# EAGLE design RoboticArm (EAGLE 9.5.1)
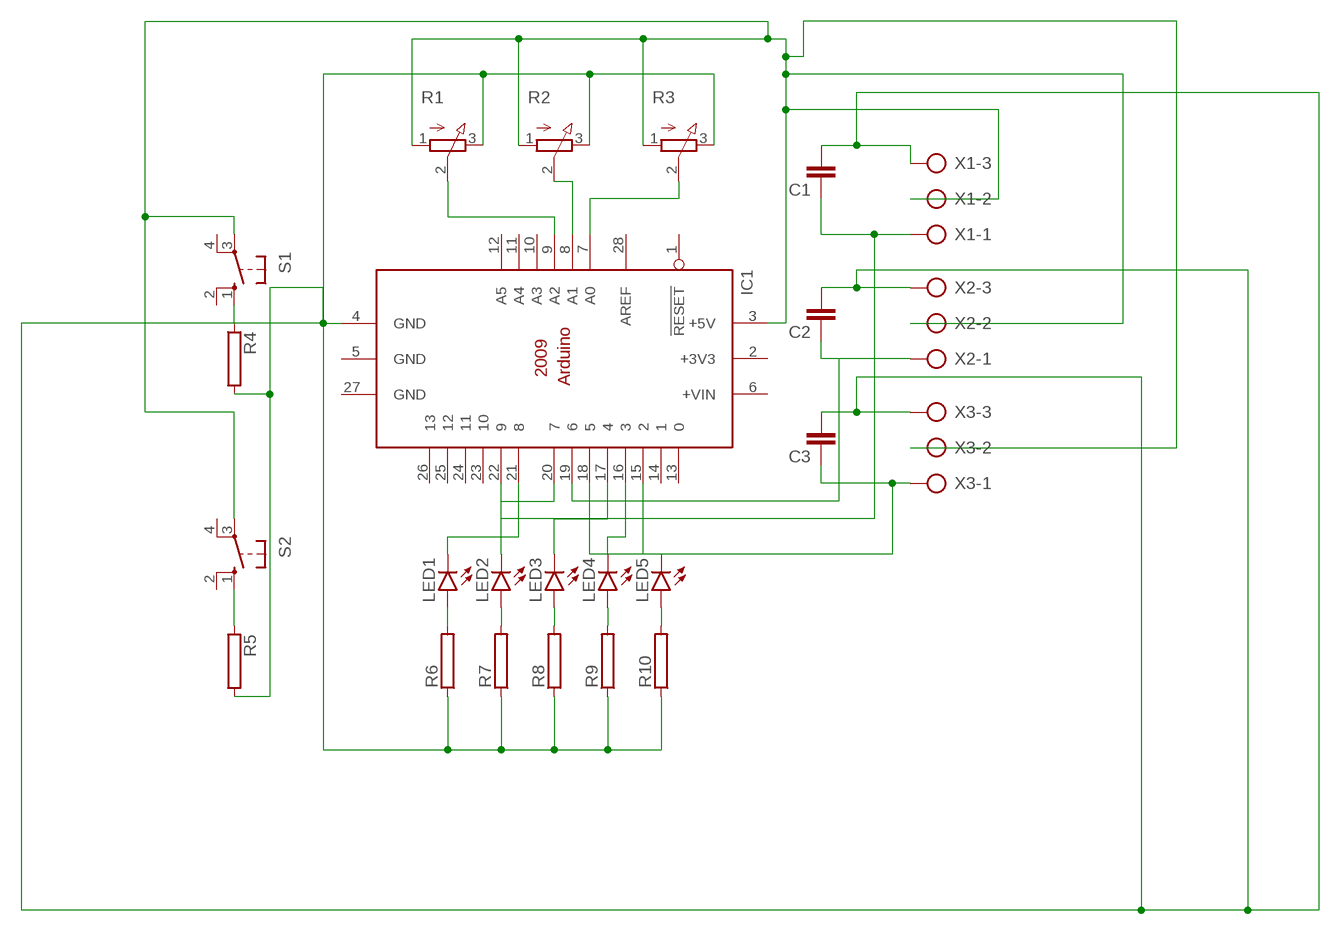
[diagram p0: schematic, sheet 1]

## Parts
C1  C2.5/2  [C2.5-2]
C2  C2.5/2  [C2.5-2]
C3  C2.5/2  [C2.5-2]
IC1  ARDUINO2009_10  [ARDUINO2009]
LED1  LED3MM  [LED3MM]
LED2  LED3MM  [LED3MM]
LED3  LED3MM  [LED3MM]
LED4  LED3MM  [LED3MM]
LED5  LED3MM  [LED3MM]
R1  3RP/1610N  [3RP/1610N]
R2  3RP/1610N  [3RP/1610N]
R3  3RP/1610N  [3RP/1610N]
R4  RAC01  [AC01]
R5  RAC01  [AC01]
R6  RAC01  [AC01]
R7  RAC01  [AC01]
R8  RAC01  [AC01]
R9  RAC01  [AC01]
R10  RAC01  [AC01]
S1  10-XX  [B3F-10XX]
S2  10-XX  [B3F-10XX]
X1  AK300/3  [AK300/3]
X2  AK300/3  [AK300/3]
X3  AK300/3  [AK300/3]

## Nets
N$1: LED1.A R6.2
N$2: IC1.15 LED5.K(C)
N$3: IC1.16 LED4.K(C)
N$4: IC1.17 LED3.K(C)
N$5: IC1.20 LED2.K(C)
N$6: IC1.21 LED1.K(C)
N$7: LED2.A R7.2
N$8: LED3.A R8.2
N$9: LED4.A R9.2
N$10: LED5.A R10.2
N$11: IC1.7(A0) R3.2(S)
N$12: R4.1 S1.1(S)
N$13: R5.1 S2.1(S)
N$14: C1.1 IC1.22 X1.1
N$15: IC1.9(A2) R1.2(S)
N$16: IC1.8(A1) R2.2(S)
N$17: IC1.3(+5V) R1.1(A) R2.1(A) R3.1(A) S1.3(P) S2.3(P) X1.2 X2.2 X3.2
N$18: C2.1 IC1.19 X2.1
N$21: C1.2 C2.2 C3.2 IC1.4(GND) R1.3(E) R2.3(E) R3.3(E) R4.2 R5.2 R6.1 R7.1 R8.1 R9.1 R10.1 X1.3 X2.3 X3.3
N$25: C3.1 IC1.18 X3.1
Unconnected: IC1.1(!RESET) IC1.6(+VIN) IC1.10(A3) IC1.11(A4) IC1.12(A5) IC1.13 IC1.14 IC1.23 IC1.24 IC1.25 IC1.26 IC1.28(AREF) S1.2(S1) S1.4(P1) S2.2(S1) S2.4(P1)

## Power pins joined to a net without a drawn wire
+3V3: IC1.2(+3V3)
GND: IC1.5(GND) IC1.27(GND)

## Library data of the parts
C1-C3 = capacitor-wima:C: CAPACITOR naming: grid - package width
IC1 = arduino:ARDUINO2009_1: The Arduino Duemilanove ("2009") is a microcontroller board based on the ATmega168 or ATmega328. - 14 digital input/output pins (of which 6 can be used as PWM outputs) - 6 analog inputs, a 16 MHz crystal oscillator - USB connection - power jack - ISP header - reset button It contains everything needed to support the microcontroller; simply connect it to a computer with a USB cable or power it with a AC-to-DC adapter or battery to get started http://arduino.cc/en/Main/ArduinoBoardDuemilanove
LED1-LED5 = led:LED: LED OSRAM: - CHIPLED LG R971, LG N971, LY N971, LG Q971, LY Q971, LO R971, LY R971 LH N974, LH R974 LS Q976, LO Q976, LY Q976 LO Q996 - Hyper CHIPLED LW Q18S LB Q993, LB Q99A, LB R99A - SideLED LS A670, LO A670, LY A670, LG A670, LP A670 LB A673, LV A673, LT A673, LW A673 LH A674 LY A675 LS A676, LA A676, LO A676, LY A676, LW A676 LS A679, LY A679, LG A679 - Hyper Micro SIDELED® LS Y876, LA Y876, LO Y876, LY Y876 LT Y87S - SmartLED LW L88C, LW L88S LB L89C, LB L89S, LG L890 LS L89K, LO L89K, LY L89K LS L896, LA L896, LO L896, LY L896 - TOPLED LS T670, LO T670, LY T670, LG T670, LP T670 LSG T670, LSP T670, LSY T670, LOP T670, LYG T670 LG T671, LOG T671, LSG T671 LB T673, LV T673, LT T673, LW T673 LH T674 LS T676, LA T676, LO T676, LY T676, LB T676, LH T676, LSB T676, LW T676 LB T67C, LV T67C, LT T67C, LS T67K, LO T67K, LY T67K, LW E67C LS E67B, LA E67B, LO E67B, LY E67B, LB E67C, LV E67C, LT E67C LW T67C LS T679, LY T679, LG T679 LS T770, LO T770, LY T770, LG T770, LP T770 LB T773, LV T773, LT T773, LW T773 LH T774 LS E675, LA E675, LY E675, LS T675 LS T776, LA T776, LO T776, LY T776, LB T776 LHGB T686 LT T68C, LB T68C - Hyper Mini TOPLED® LB M676 - Mini TOPLED Santana® LG M470 LS M47K, LO M47K, LY M47K Source: http://www.osram.convergy.de LUXEON: - LUMILED® LXK2-PW12-R00, LXK2-PW12-S00, LXK2-PW14-U00, LXK2-PW14-V00 LXK2-PM12-R00, LXK2-PM12-S00, LXK2-PM14-U00 LXK2-PE12-Q00, LXK2-PE12-R00, LXK2-PE12-S00, LXK2-PE14-T00, LXK2-PE14-U00 LXK2-PB12-K00, LXK2-PB12-L00, LXK2-PB12-M00, LXK2-PB14-N00, LXK2-PB14-P00, LXK2-PB14-Q00 LXK2-PR12-L00, LXK2-PR12-M00, LXK2-PR14-Q00, LXK2-PR14-R00 LXK2-PD12-Q00, LXK2-PD12-R00, LXK2-PD12-S00 LXK2-PH12-R00, LXK2-PH12-S00 LXK2-PL12-P00, LXK2-PL12-Q00, LXK2-PL12-R00 Source: www.luxeon.com KINGBRIGHT: KA-3528ASYC Source: www.kingbright.com
R1-R3 = pot:3RP/1610N: 16mm Potentiometer one level Source: http://www.alphapotentiometers.net/html/16mm_pot_2.html
R4-R10 = resistor-power:R: Power Resitor; OC_FARNELL: unknown; OC_NEWARK: unknown
S1 S2 = switch-omron:10-XX: OMRON SWITCH; MPN: B3F-1000; OC_FARNELL: 176432; OC_NEWARK: 36M3542
X1-X3 = con-ptr500:AK300/3: CONNECTOR; OC_FARNELL: unknown; OC_NEWARK: unknown

## Net classes
0 default: width 1.016 mm, clearance 0.254 mm

## Board
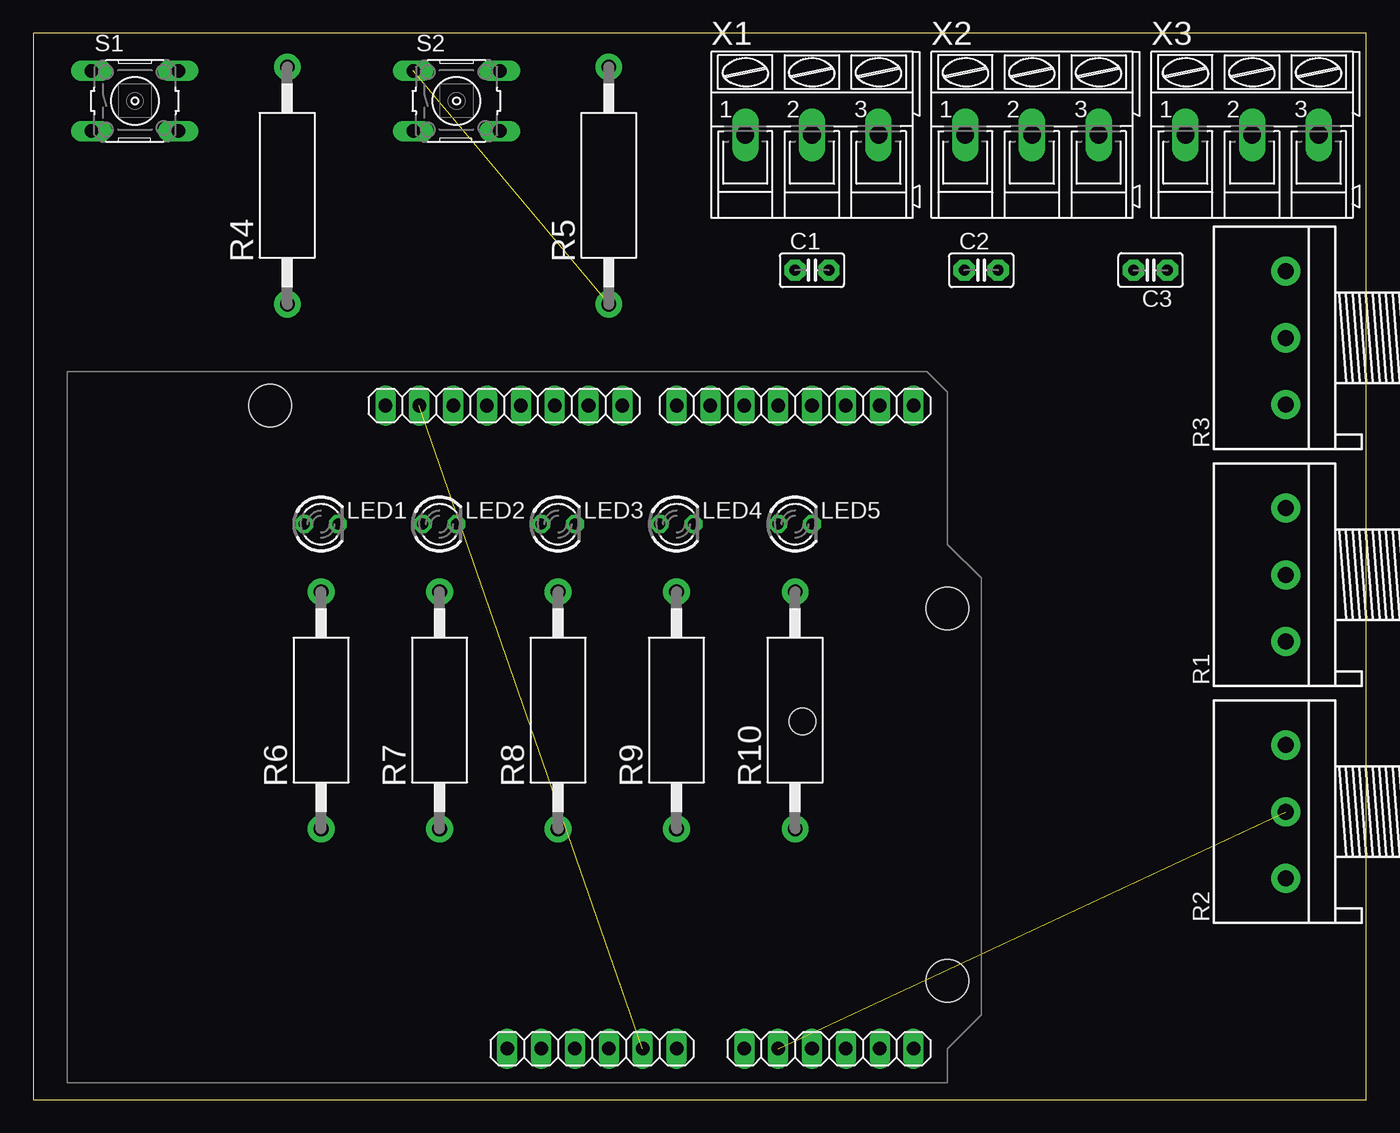
[diagram p1: board, top side]
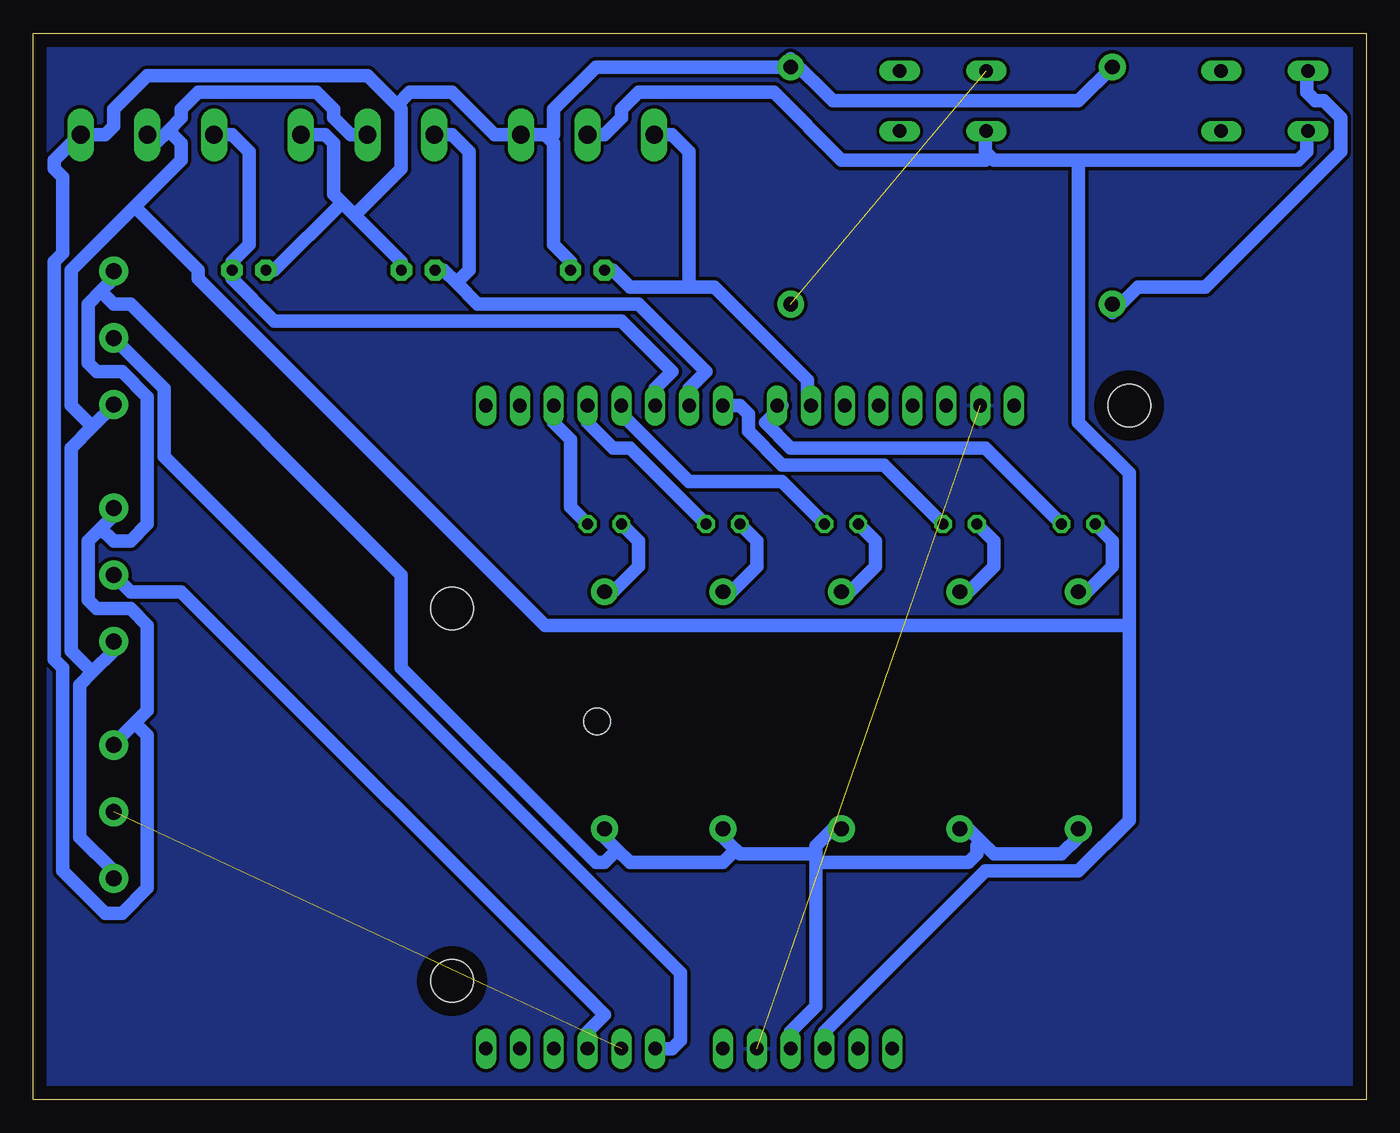
[diagram p2: board, bottom side, seen from below]

Size 100 x 80 mm. Coordinates in mm from the lower left corner, seen from the top.
Outline: 0,0 100,0 100,80 0,80 0,0
Copper layers (1*16): Top 0.035mm / dielectric 1.5mm / Bottom 0.035mm
Design rules "default": minimum track width 6mil, minimum drill 0.35mm, track to track 6mil, track to pad 6mil, pad to pad 6mil, via to via 6mil, smd to smd 6mil, copper to edge 40mil, drill to drill 6mil, minimum pad ring 10mil, minimum via ring 8mil, stop-mask expansion 4mil, vias tented up to drill 0mil, thermal gap 10mil

### Footprints (pad centres in the part's own frame; a part is rotated, then mirrored left to right if it is on the bottom)
C2.5-2 = drill 0.813 pad 1.6 octagon: 1 -1.27,0; 2 1.27,0
ARDUINO2009 = drill 1.016 long: 1 33.02,2.54; 2 35.56,2.54; 3 38.1,2.54; 4 40.64,2.54; 5 43.18,2.54; 6 45.72,2.54; 7 50.8,2.54; 8 53.34,2.54; 9 55.88,2.54; 10 58.42,2.54; 11 60.96,2.54; 12 63.5,2.54; 13 63.5,50.8; 14 60.96,50.8; 15 58.42,50.8; 16 55.88,50.8; 17 53.34,50.8; 18 50.8,50.8; 19 48.26,50.8; 20 45.72,50.8; 21 41.656,50.8; 22 39.116,50.8; 23 36.576,50.8; 24 34.036,50.8; 25 31.496,50.8; 26 28.956,50.8; 27 26.416,50.8; 28 23.876,50.8 | hole 3.2: 15.24,50.8; 66.04,35.56; 66.04,7.62 | hole 2: 55.17,27.114
LED3MM = drill 0.813 octagon: A -1.27,0; K 1.27,0
3RP/1610N = drill 1.2 pad 2.184: 1 -5,0; 2 0,0; 3 5,0
AC01 = drill 1.1 pad 2: 1 -8.9,0; 2 8.9,0
B3F-10XX = drill 1.016 long: 1 -3.251,2.261; 2 3.251,2.261; 3 -3.251,-2.261; 4 3.251,-2.261
AK300/3 = drill 1.321 long: 1 -5.004,0; 2 0,0; 3 5.004,0

### Placement (x,y rotation side)
C1  58.42,62.23 0 top
C2  71.12,62.23 0 top
C3  83.82,62.23 180 top
IC1  2.54,1.27 0 top
LED1  21.59,43.18 0 top
LED2  30.48,43.18 0 top
LED3  39.37,43.18 0 top
LED4  48.26,43.18 0 top
LED5  57.15,43.18 0 top
R1  93.98,39.37 90 top
R2  93.98,21.59 90 top
R3  93.98,57.15 90 top
R4  19.05,68.58 90 top
R5  43.18,68.58 90 top
R6  21.59,29.21 90 top
R7  30.48,29.21 90 top
R8  39.37,29.21 90 top
R9  48.26,29.21 90 top
R10  57.15,29.21 90 top
S1  7.62,74.93 0 top
S2  31.75,74.93 0 top
X1  58.42,72.39 0 top
X2  74.93,72.39 0 top
X3  91.44,72.39 0 top

### Tracks (layer width: path | path; a pad name or v marks a point on that pad's centre or on a via)
GND  (1 unrouted)
  pour Bottom: 0,80.01 0,0 100.33,0 100.33,80.01
N$1
  Bottom 1.016: LED1.A 19.05,41.91 19.05,40.01 20.95,38.1 R6.2
N$2
  Bottom 1.016: LED5.K 59.69,44.45 59.69,49.53 60.96,50.8 IC1.15
N$3
  Bottom 1.016: LED4.K 55.24,48.9 56.52,48.9 58.42,50.8 IC1.16
N$4
  Bottom 1.016: LED3.K 43.81,46.35 50.8,46.35 55.88,51.44 IC1.17
N$5
  Bottom 1.016: LED2.K 36.2,47.62 43.81,47.62 46.35,50.16 46.35,51.44 46.99,52.07 IC1.20
N$6
  Bottom 1.016: LED1.K 28.57,48.9 43.18,48.9 45.09,50.8 43.81,52.07 IC1.21
N$7
  Bottom 1.016: LED2.A 27.94,41.91 27.94,40.01 29.84,38.1 R7.2
N$8
  Bottom 1.016: LED3.A 36.83,41.91 36.83,40.01 38.73,38.1 R8.2
N$9
  Bottom 1.016: LED4.A 45.72,41.91 45.72,40.01 47.62,38.1 R9.2
N$10
  Bottom 1.016: LED5.A 54.61,41.91 54.61,40.01 56.52,38.1 R10.2
N$11
  Bottom 1.016: IC1.7 52.07,3.81 51.44,4.45 51.44,9.53 90.17,48.26 90.17,53.34 R3.2
N$12
  Bottom 1.016: S1.1 4.45,76.83 4.45,75.56 3.81,74.93 3.17,74.93 1.91,73.66 1.91,71.12 12.06,60.96 17.14,60.96 19.05,59.05 R4.1
N$13  (1 unrouted)
N$14
  Bottom 1.016: 50.8,60.96 55.24,60.96 56.52,62.23 C1.1 | 50.8,60.96 48.9,60.96 41.91,53.98 41.91,52.07 IC1.22 | X1.1 52.07,72.39 50.8,71.12 50.8,60.96
N$15
  Bottom 1.016: IC1.9 58.42,5.08 57.15,6.35 88.9,38.1 92.71,38.1 R1.2
N$16  (1 unrouted)
N$17
  Bottom 1.016: X2.2 76.2,72.39 77.47,73.66 77.47,74.3 78.74,75.56 87.63,75.56 88.9,74.3 88.9,73.66 89.85,72.71 | 89.85,72.71 90.81,71.75 91.44,71.75 X3.2 | 95.57,32.07 93.98,33.66 R1.1 | 95.57,32.07 96.52,31.11 96.52,19.68 93.98,17.14 R2.1 | 95.57,50.48 97.16,48.9 97.16,33.66 95.57,32.07 | 95.57,50.48 93.98,52.07 R3.1 | 89.85,72.71 88.9,71.75 88.9,70.48 92.39,66.99 | 92.39,66.99 97.16,62.23 97.16,52.07 95.57,50.48 | 21.59,70.48 27.94,70.48 28.26,70.8 | 21.59,70.48 5.08,70.48 4.45,71.12 4.45,72.39 S1.3 | 28.26,70.8 28.57,71.12 28.57,72.39 S2.3 | IC1.3 40.64,5.08 28.57,17.14 21.59,17.14 17.78,20.95 17.78,35.56 | 17.78,35.56 17.78,46.99 21.59,50.8 21.59,70.48 | X1.2 57.15,72.39 55.88,73.66 55.88,74.3 54.61,75.56 44.45,75.56 39.37,70.48 28.57,70.48 28.26,70.8 | 92.39,66.99 87.63,62.23 87.63,61.59 61.59,35.56 17.78,35.56
N$18
  Bottom 1.016: IC1.19 50.8,53.34 49.53,54.61 54.61,59.69 66.67,59.69 68.26,61.28 | 68.26,61.28 69.22,62.23 C2.1 | X2.1 68.58,72.39 67.31,71.12 67.31,62.23 68.26,61.28
N$21
  Bottom 1.016: R4.2 21.59,74.93 40.01,74.93 43.18,78.11 R5.2 57.78,77.47 60.96,74.3 60.96,72.39 61.28,72.07 | C1.2 59.69,62.87 60.96,64.14 60.96,71.75 61.28,72.07 | 61.28,72.07 61.59,72.39 X1.3 65.41,72.39 68.58,75.56 71.75,75.56 72.71,74.61 | C2.2 72.39,62.87 75.88,66.36 | 76.83,67.31 77.47,67.94 77.47,71.75 78.11,72.39 X2.3 | 76.83,67.31 75.88,66.36 | C3.2 81.92,62.23 76.83,67.31 | 72.71,74.61 72.39,74.3 72.39,69.85 75.88,66.36 | 72.71,74.61 74.93,76.83 91.44,76.83 93.98,74.3 93.98,73.03 94.61,72.39 X3.3 96.52,72.39 98.42,70.48 98.42,69.85 97.79,69.22 97.79,63.5 98.42,62.87 98.42,33.02 97.79,32.38 97.79,17.14 94.61,13.97 93.34,13.97 91.44,15.88 91.44,27.3 92.39,28.26 | 92.39,28.26 91.44,29.21 91.44,35.56 92.71,36.83 95.25,36.83 95.89,37.47 95.89,41.91 94.93,42.86 | 92.39,28.26 93.98,26.67 R2.3 | 94.93,42.86 93.98,43.81 R1.3 | 94.93,60.64 95.89,59.69 95.89,55.24 95.25,54.61 93.34,54.61 91.44,52.7 91.44,43.18 92.71,41.91 93.98,41.91 94.93,42.86 | 94.93,60.64 93.98,61.59 R3.3 | 28.89,19.37 29.84,20.32 R7.1 | 28.89,19.37 27.94,18.41 22.86,18.41 21.59,19.68 R6.1 | IC1.4 43.18,5.08 41.27,6.99 41.27,17.78 | 41.27,18.41 41.27,19.05 40.01,20.32 R8.1 | 41.27,18.41 41.27,17.78 | 47.31,18.73 46.99,18.41 41.27,18.41 | 47.31,18.73 48.26,19.68 R9.1 | 56.2,18.73 55.24,17.78 48.26,17.78 47.31,18.73 | 56.2,18.73 57.15,19.68 R10.1 | 41.27,17.78 29.84,17.78 29.21,18.41 29.21,19.05 28.89,19.37 | 94.93,60.64 93.98,59.69 92.71,59.69 72.39,39.37 72.39,32.38 57.78,17.78 57.15,17.78 56.2,18.73
N$25
  Bottom 1.016: IC1.18 53.34,53.34 52.07,54.61 55.88,58.42 81.92,58.42 85.09,61.59 C3.1 85.09,62.87 83.82,64.14 83.82,71.12 85.09,72.39 X3.1